# Altium schematic sheet UI.SchDoc
size A4; SheetNumber: 5; SheetTotal: 6
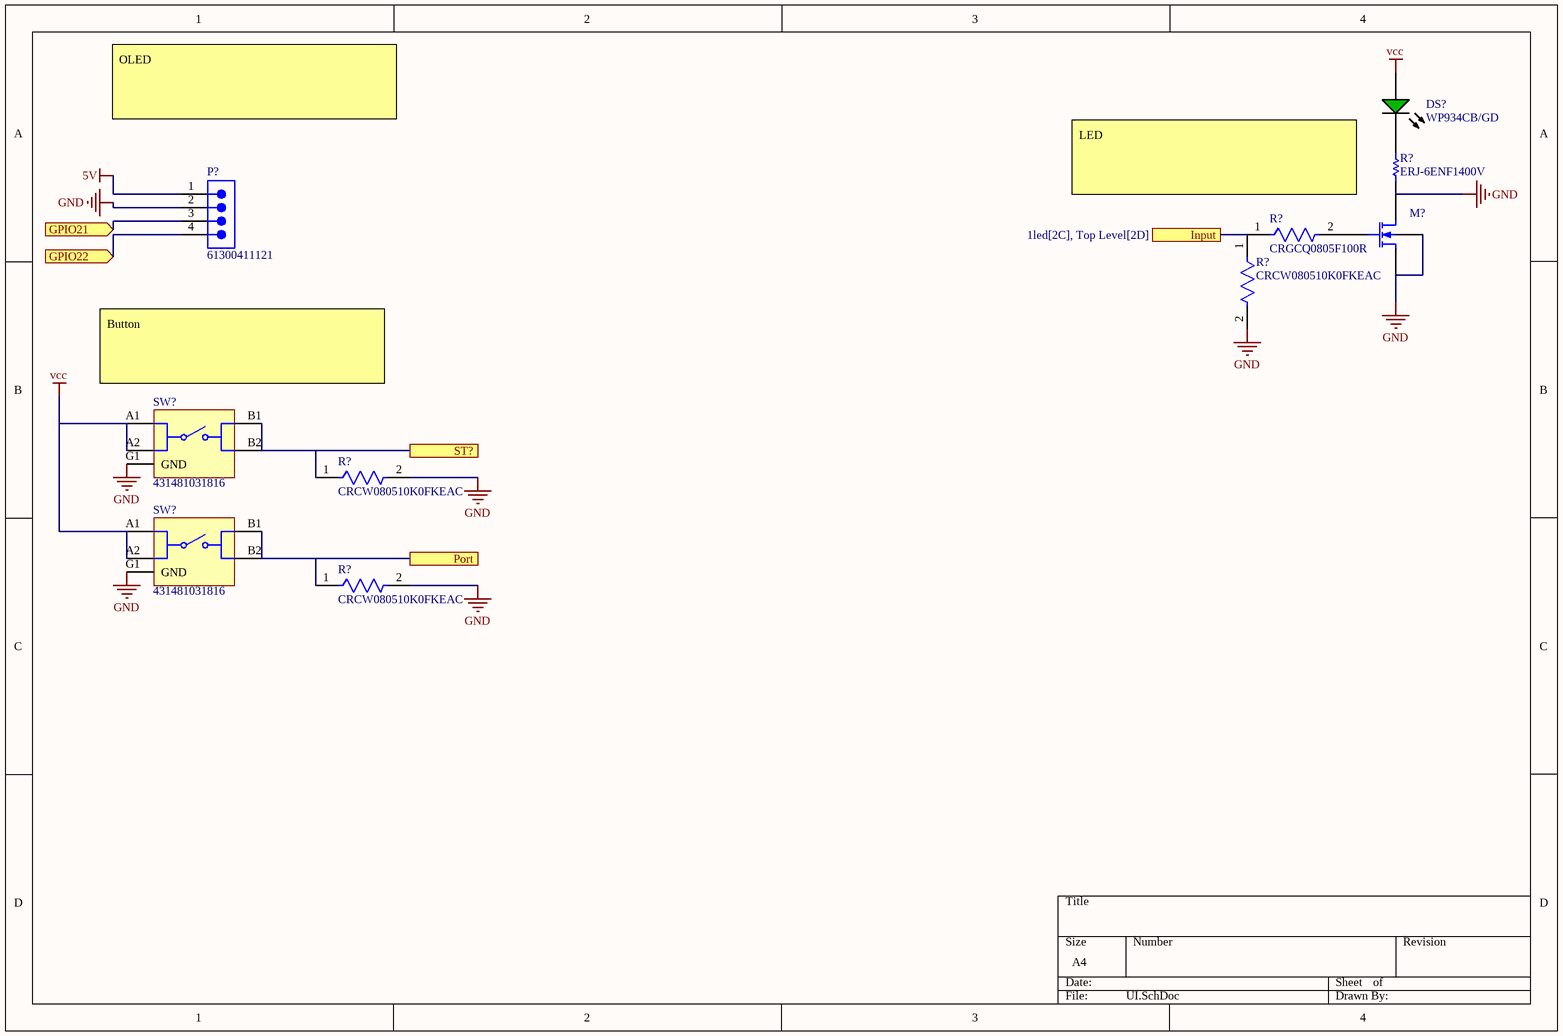
[diagram p0: UI.SchDoc]

## Parts
(Parts that share a designator on the sheet are numbered #1, #2 ... from top to bottom, then left to right.)
DS?  WP934CB/GD  [KING-WP934CBGD_V]
M?  N-channel MOS1 MOSFET Shichman and Hodges Model  (value not drawn)
P?  61300411121  [61300411121]
R?#1  ERJ-6ENF1400V  [RESC2013X70X40ML20T20]
R?#2  CRCW080510K0FKEAC  [FP-CRCW0805-Ce3-MFG]
R?#3  CRGCQ0805F100R  [FP-CRGCQ0805-IPC_C]
R?#4  CRCW080510K0FKEAC  [FP-CRCW0805-Ce3-MFG]
R?#5  CRCW080510K0FKEAC  [FP-CRCW0805-Ce3-MFG]
SW?#1  431481031816  [431481031816]
SW?#2  431481031816  [431481031816]

## Ports
GPIO21 (in), GPIO22 (in), Input (see 1led[2C], Top Level[2D]), Port, ST?

## Nets
5V: P?.1
GND: M?.1(D) M?.3(S) M?.4(B) P?.2 R?#1.1 R?#2.2 R?#4.2 R?#5.2 SW?#1.G1(GND) SW?#2.G1(GND)
vcc: DS?.2(A) SW?#1.A1 SW?#1.A2 SW?#2.A1 SW?#2.A2
GPIO21: P?.3 ; port GPIO21
GPIO22: P?.4 ; port GPIO22
Input: R?#2.1 R?#3.1 ; port Input
Port: R?#5.1 SW?#2.B1 SW?#2.B2 ; port Port
ST?: R?#4.1 SW?#1.B1 SW?#1.B2 ; port ST?
NetDS?_1: DS?.1(K) R?#1.2
NetM?_2: M?.2(G) R?#3.2

## Notes on the sheet
- OLED
- LED
- (near SW?#1) Button

## Library data of the parts
DS? = CMP-2000-07417-1: Right Angle LED Indicator, 62.5 mW, 25 mA, -40 to 85 degC, 2-Pin THD, RoHS, Bulk; Manufacturer: Kingbright; Voltage Rating: 2.2V; Configuration: Single; Other Names: 754-1297 / WP934CBGD; Lens Style/Size: RoundwithDomedTop,3mm; Catalog Drawings: WP934CBSeriesFront / WP934CBSeriesSide; Millicandela Rating: 22.5mcd; Minimum Quantity: Green; 3D Model: WP934CB/x.sldprt / WP934CB/x.pro / WP934CB/x.igs / WP934CB/x.stp; Wavelength - Peak: 568nm; Lens Type: Diffused,Tinted; Dynamic Catalog: SingleLevel3mm(T1)SingleColorRightAngleLEDs; Viewing Angle: 40°; Current: 20mA; Packaging: Bulk; Package Reference: WP934CBGD; Datasheet Version: Rev. 10B, 09/2016; Family: LEDs-CircuitBoardIndicators,Arrays,LightBars,BarGraphs; Manufacturer URL: http://www.kingbright.com/; Standard Package: 500; Mounting Technology: ThroughHole; Quantity Available: Bulk; Category: Optoelectronics; Color: Green; Package Description: 2-Pin Through Hole Device, Body 4.6 x 8.75 mm; Mounting Type: ThroughHole,RightAngle; Datasheet URL: http://www.kingbrightusa.com/images/catalog/SPEC/WP934CB-GD.pdf
M? = MOSFET N-ch Lev1: CBD: 0; FC: 0.5; IS: 1e-14; KP: 2e-05; PB: 0.8; PHI: 0.6; TNOM: 27; SimulationGenericComponent: True; CBS: 0; CGBO: 0; CGDO: 0; CGSO: 0; CJ: 0; CJSW: 0; GAMMA: 0; JS: 0; LAMBDA: 0; LD: 0; MJ: 0.5; MJSW: 0.5; NSS: 0; NSUB: 0; RD: 0; RS: 0; RSH: 0; TOX: 0; TPG: 0; U0: 0; VTO: 0
P? = CMP-1502-01064-3: NexarPartId: 32855522; Operating Supply Voltage: 250V; Pitch: 2.54mm; Contact Resistance: 20mΩ; Number of Positions: 4; Current Rating: 3A; Connector Type: Male Pin; Gender: Male; Contact Plating: Gold; Height: 8.89mm; Lead Pitch: 2.54mm; Lead Free: Lead Free; Contact Mating Length: 5.9944mm; Number of Rows: 1; Termination: Solder; Packaging: Bulk; REACH SVHC: Unknown; Min Operating Temperature: -40°C; RoHS: Compliant; Number of Contacts: 4; Voltage Rating: 250V; Color: Black; Max Operating Temperature: 105°C; Contact Material: Copper; Mount: Through Hole; Orientation: Vertical; Number of Pins: 4
R?#1 = CMP-2001-04427-1: Manufacturer: Panasonic; Part Number: ERJ-6ENF1400V
R?#2 R?#4 R?#5 = CMP-02407-011560-1: RES 10K OHM 1% 1/8W 0805; Resistance: 10000R; Power Rating: 125mW; RoHS Compliant: Yes; Case/Package: 0805; Tolerance: 1%; Lead Free: Lead Free
R?#3 = CMP-03211-005874-1: CRGCQ0805 100Ω 0.125W ±200ppm/°C 1% 150V; Manufacturer: TE Connectivity; Automotive Grade: Grade 457; Tolerance: 0.01; Height: 0.65mm; Voltage Rating: 150V; Power Rating: 0.125W; Composition: Thick Film; Ambient Temperature Range High: +70°C; ComponentLink2URL: https://www.te.com/commerce/DocumentDelivery/DDEController?Action=showdoc&DocId=Data+Sheet%7F1773204-3%7F1%7Fpdf%7FEnglish%7FENG_DS_1773204-3_1.pdf%7F4-2176341-466; Temperature: -55°C to +155°C; Mouser Description: SMD AEC-Q200 Compliant Thick Film Chip Resistor; Lead Free: Yes; Temperature Range High: +155°C; Ipc Land Pattern Name: RESC200125X55; Automotive: Yes; Package: CRGCQ0805; Manufacturer Part Number: CRGCQ0805F100R; Device Class L3: Chip SMD Resistors; Octopart: https://octopart.com/crgcq0805f100r-te+connectivity-91018139; Category: Res; RoHS: TRUE; ComponentLink2Description: Datasheet; Temperature Range Low: -55°C; Device Class L1: Passive Components; Device Class L2: Resistors; Series: CRGCQ; Value: 100Ω; Resistance: 100Ω; Temperature Coefficient: ±200ppm/°C
SW?#1 SW?#2 = CMP-1457-00011-3: Tactile Switch, 0.05A, 12Vdc, 160Gf, Smd Rohs Compliant: Yes; Illumination Type: Non-Illuminated; Mechanical Life: 1Mcycles; Current Rating: 50mA; Voltage Rating: 12V; Switch Travel: 250µm; Actuator Material: Liquid Crystal Polymer, Polymer; Insulation Resistance: 100MΩ; Switch Function: Off-Mom; Throw Configuration: SPST; Contact Plating: Silver; RoHS: Compliant; Termination: SMD/SMT; Max Operating Temperature: 85°C; Height: 3.1mm; Packaging: Tape and Reel; Min Operating Temperature: -40°C; Mount: Surface Mount